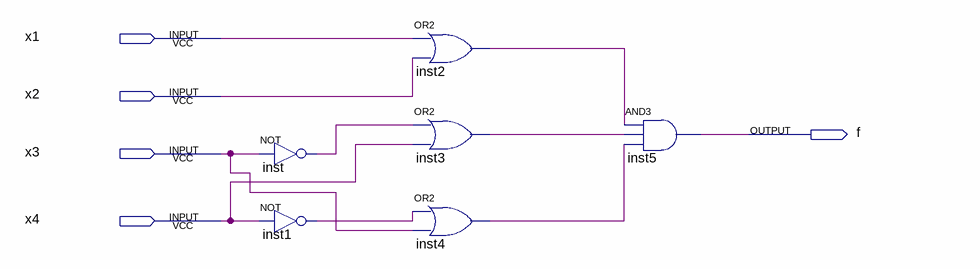
[diagram p0: schematic sheet]
// Quartus schematic ask2.bdf as structural Verilog: 6 symbols, 5 pins
module ask2 (
  input  x1,
  input  x2,
  input  x3,
  input  x4,
  output f
);

  wire inst1_out, inst2_out, inst3_out, inst4_out, inst_out;

  not inst (inst_out, x3);
  not inst1 (inst1_out, x4);
  or inst2 (inst2_out, x1, x2);
  or inst3 (inst3_out, inst_out, x4);
  or inst4 (inst4_out, inst1_out, x3);
  and inst5 (f, inst2_out, inst3_out, inst4_out);
endmodule
